# EAGLE design ALLtheLEDs (EAGLE 5.09)
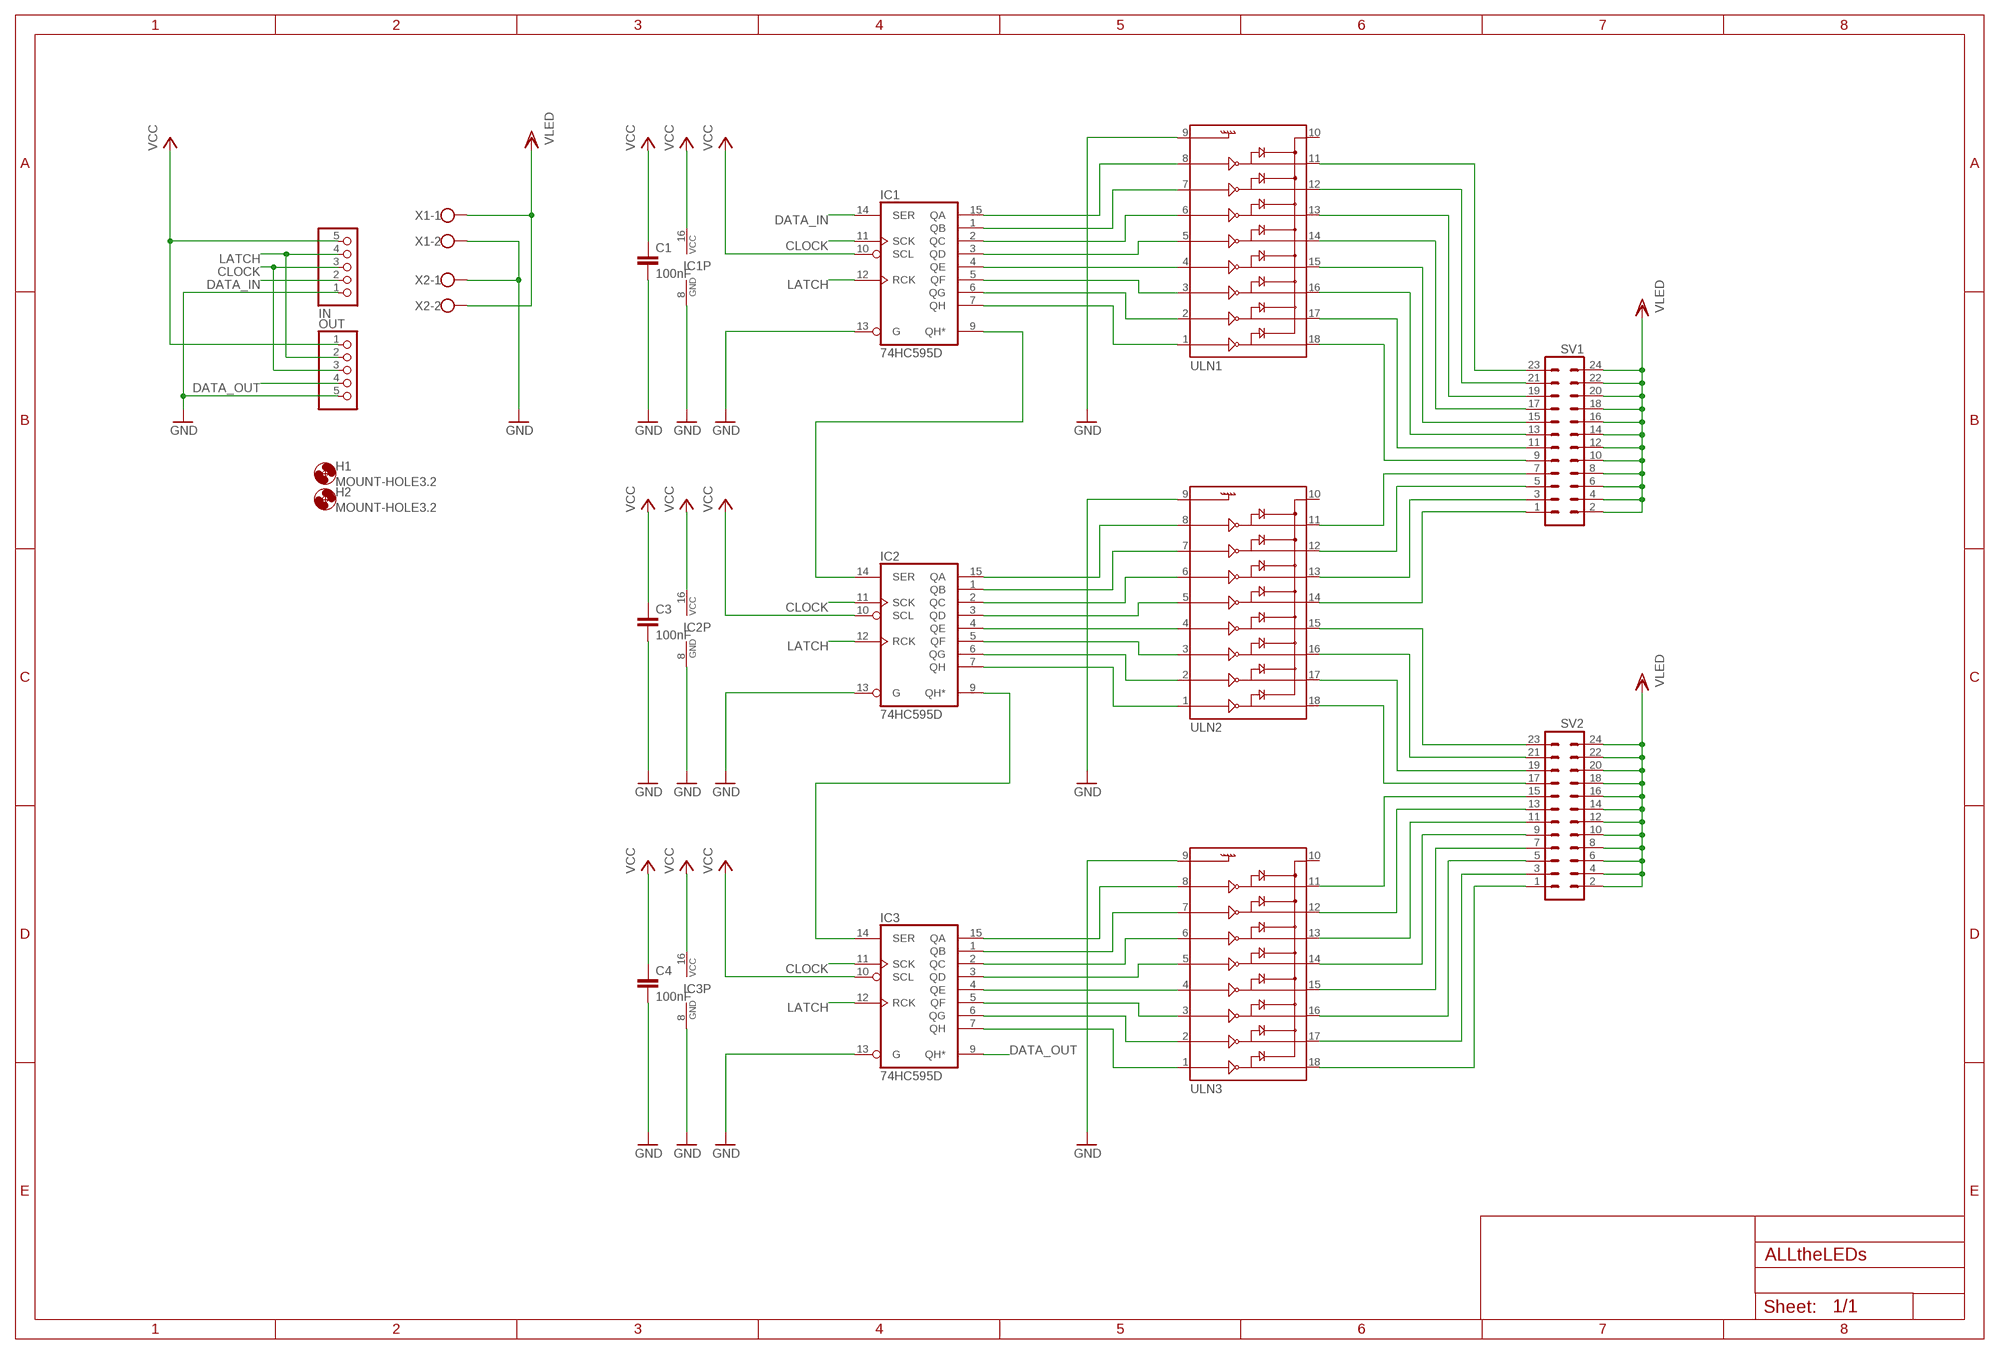
[diagram p0: schematic, sheet 1]

## Parts
C1  100nF  C-EUC0603  [C0603]
C3  100nF  C-EUC0603  [C0603]
C4  100nF  C-EUC0603  [C0603]
H1  MOUNT-HOLE3.2  [3,2]
H2  MOUNT-HOLE3.2  [3,2]
IC1  74HC595D  [SO16]
IC2  74HC595D  [SO16]
IC3  74HC595D  [SO16]
IN  PINHD-1X5/90  [1X05/90]
OUT  PINHD-1X5/90  [1X05/90]
SV1  MA12-2W  [MA12-2W]
SV2  MA12-2W  [MA12-2W]
ULN1  ULN2803SOICW  [SO18L]
ULN2  ULN2803SOICW  [SO18L]
ULN3  ULN2803SOICW  [SO18L]
X1  W237-102  [W237-102]
X2  W237-102  [W237-102]

## Nets
CLOCK: IC1.11(SCK) IC2.11(SCK) IC3.11(SCK) IN.3 OUT.3
DATA_IN: IC1.14(SER) IN.2
DATA_OUT: IC3.9(QH*) OUT.4
GND: C1.2 C3.2 C4.2 IC1.8(GND) IC1.13(G) IC2.8(GND) IC2.13(G) IC3.8(GND) IC3.13(G) IN.1 OUT.5 ULN1.9 ULN2.9 ULN3.9 X1.2 X2.1
LATCH: IC1.12(RCK) IC2.12(RCK) IC3.12(RCK) IN.4 OUT.2
N$1: IC1.15(QA) ULN1.8
N$2: IC1.1(QB) ULN1.7
N$3: IC1.2(QC) ULN1.6
N$4: IC1.3(QD) ULN1.5
N$5: IC1.4(QE) ULN1.4
N$6: IC1.5(QF) ULN1.3
N$7: IC1.6(QG) ULN1.2
N$8: IC1.7(QH) ULN1.1
N$9: IC2.15(QA) ULN2.8
N$10: IC2.1(QB) ULN2.7
N$11: IC2.2(QC) ULN2.6
N$12: IC2.3(QD) ULN2.5
N$13: IC2.4(QE) ULN2.4
N$14: IC2.5(QF) ULN2.3
N$15: IC2.6(QG) ULN2.2
N$16: IC2.7(QH) ULN2.1
N$17: IC3.15(QA) ULN3.8
N$18: IC3.1(QB) ULN3.7
N$19: IC3.2(QC) ULN3.6
N$20: IC3.3(QD) ULN3.5
N$21: IC3.4(QE) ULN3.4
N$22: IC3.5(QF) ULN3.3
N$23: IC3.6(QG) ULN3.2
N$24: IC3.7(QH) ULN3.1
N$25: IC2.9(QH*) IC3.14(SER)
N$26: IC1.9(QH*) IC2.14(SER)
N$27: SV1.23 ULN1.11
N$28: SV1.21 ULN1.12
N$29: SV1.19 ULN1.13
N$30: SV1.17 ULN1.14
N$31: SV1.15 ULN1.15
N$32: SV1.13 ULN1.16
N$33: SV1.11 ULN1.17
N$34: SV1.9 ULN1.18
N$35: SV1.1 ULN2.14
N$36: SV1.7 ULN2.11
N$37: SV1.5 ULN2.12
N$38: SV1.3 ULN2.13
N$39: SV2.1 ULN3.18
N$40: SV2.3 ULN3.17
N$41: SV2.5 ULN3.16
N$42: SV2.7 ULN3.15
N$43: SV2.9 ULN3.14
N$44: SV2.11 ULN3.13
N$45: SV2.13 ULN3.12
N$46: SV2.15 ULN3.11
N$47: SV2.17 ULN2.18
N$48: SV2.19 ULN2.17
N$49: SV2.21 ULN2.16
N$50: SV2.23 ULN2.15
VCC: C1.1 C3.1 C4.1 IC1.10(SCL) IC1.16(VCC) IC2.10(SCL) IC2.16(VCC) IC3.10(SCL) IC3.16(VCC) IN.5 OUT.1
VSS: SV1.2 SV1.4 SV1.6 SV1.8 SV1.10 SV1.12 SV1.14 SV1.16 SV1.18 SV1.20 SV1.22 SV1.24 SV2.2 SV2.4 SV2.6 SV2.8 SV2.10 SV2.12 SV2.14 SV2.16 SV2.18 SV2.20 SV2.22 SV2.24 X1.1 X2.2 ; supply symbol labelled VLED
Unconnected: ULN1.10 ULN2.10 ULN3.10

## Library data of the parts
C1 C3 C4 = rcl:C-EU: CAPACITOR, European symbol
H1 H2 = holes:MOUNT-HOLE: MOUNTING HOLE with drill center marker
IC1-IC3 = 74xx-eu:74*595: 8-bit SHIFT REGISTER, output latch
IN OUT = pinhead:PINHD-1X5: PIN HEADER
SV1 SV2 = con-lstb:MA12-2W: PIN HEADER
ULN1-ULN3 = SparkFun:ULN2803: Darlington Driver ULN2803 Darlington array. 500mA max per channel, 8-channel package. Spark Fun Electronics SKU : COM-00312
X1 X2 = con-wago-500:W237-102: WAGO SCREW CLAMP

## Board
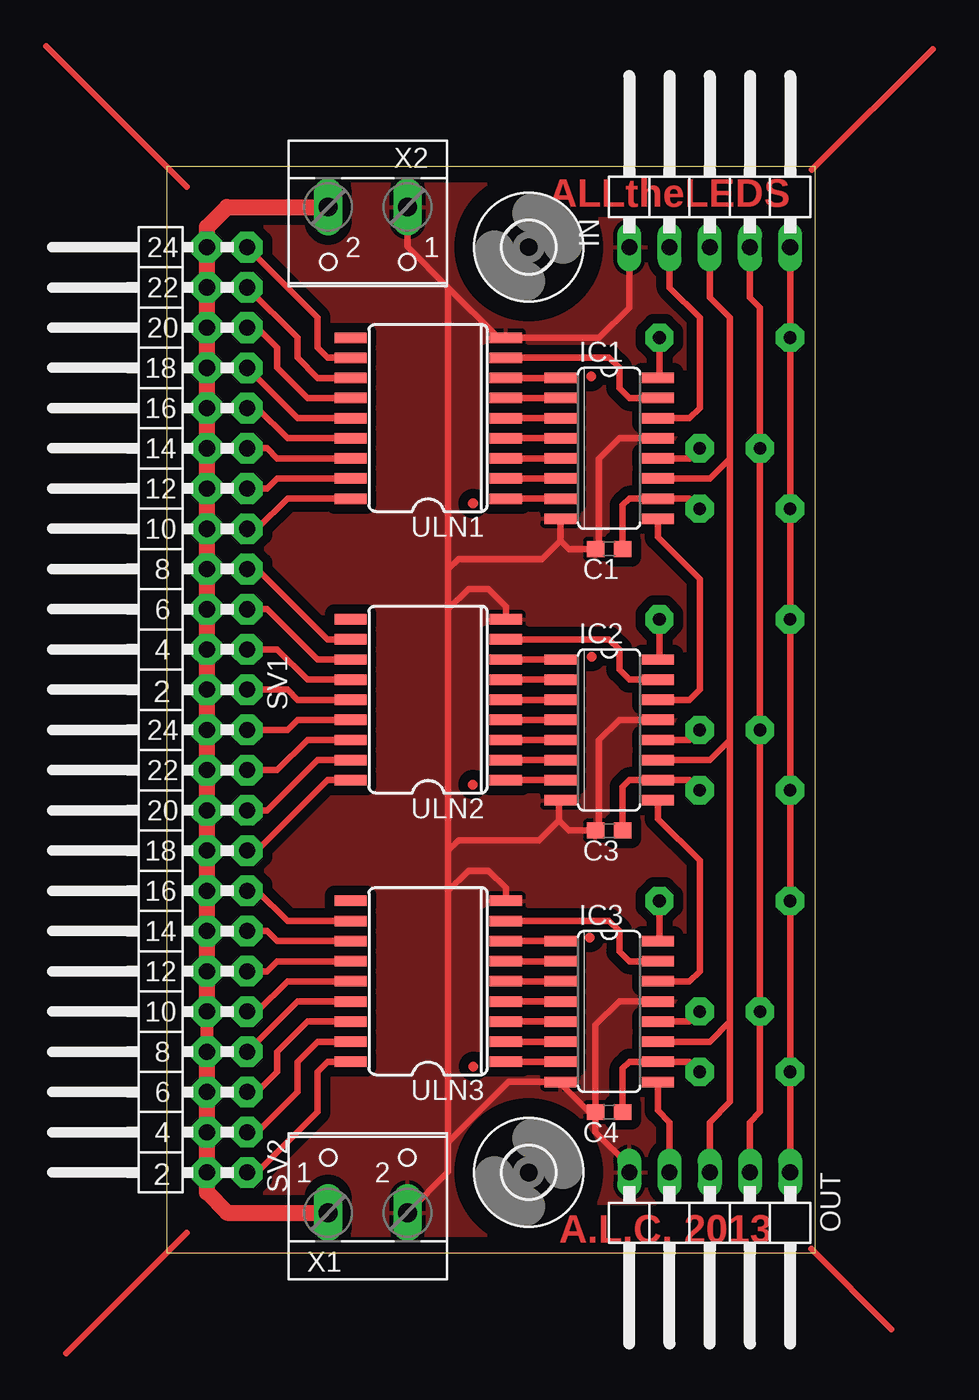
[diagram p1: board, top side]
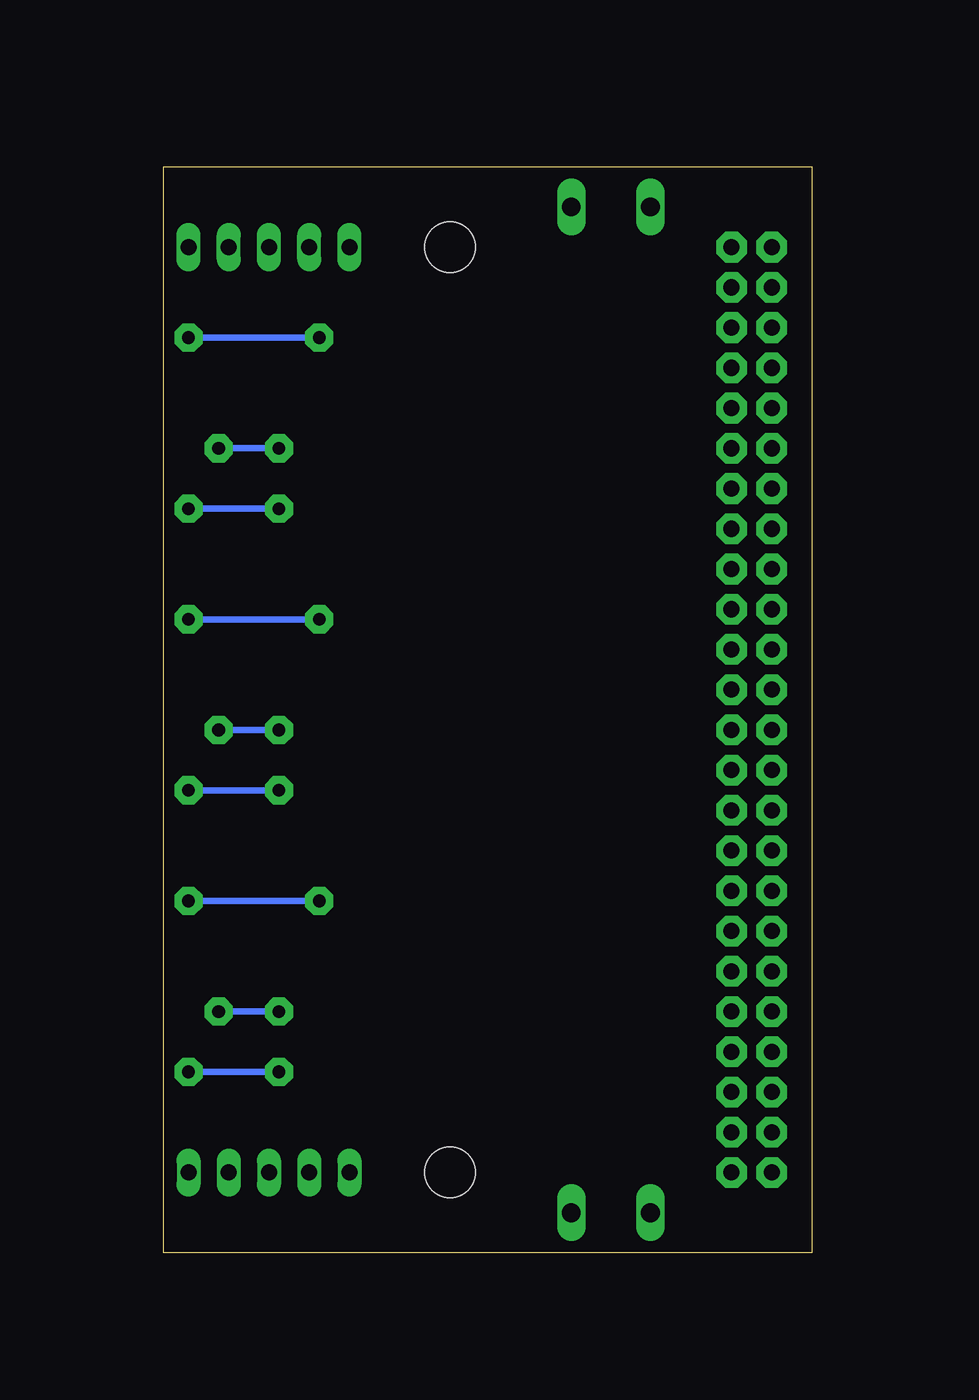
[diagram p2: board, bottom side, seen from below]

Size 40.95 x 68.57 mm. Coordinates in mm from the lower left corner, seen from the top.
Outline: 0,0 40.95,0 40.95,68.57 0,68.57 0,0
Copper layers (1*16): Top 0.035mm / dielectric 1.5mm / Bottom 0.035mm
Design rules "default": minimum track width 10mil, minimum drill 24mil, track to track 8mil, track to pad 8mil, pad to pad 8mil, via to via 8mil, smd to smd 8mil, copper to edge 40mil, drill to drill 8mil, minimum pad ring 10mil, minimum via ring 8mil, stop-mask expansion 4mil, vias tented up to drill 0mil, thermal gap 10mil

### Footprints (pad centres in the part's own frame; a part is rotated, then mirrored left to right if it is on the bottom)
C0603 = smd 1.1 x 1: 1 -0.85,0; 2 0.85,0
3,2 = hole 3.2: 0,0
SO16 = smd 0.66 x 2.032: 1 -4.445,-3.073; 2 -3.175,-3.073; 3 -1.905,-3.073; 4 -0.635,-3.073; 5 0.635,-3.073; 6 1.905,-3.073; 7 3.175,-3.073; 8 4.445,-3.073; 9 4.445,3.073; 10 3.175,3.073; 11 1.905,3.073; 12 0.635,3.073; 13 -0.635,3.073; 14 -1.905,3.073; 15 -3.175,3.073; 16 -4.445,3.073
1X05/90 = drill 1.016 long: 1 -5.08,-3.81; 2 -2.54,-3.81; 3 0,-3.81; 4 2.54,-3.81; 5 5.08,-3.81
MA12-2W = drill 1.016 pad 1.93 octagon: 1 -13.97,-1.27; 2 -13.97,1.27; 3 -11.43,-1.27; 4 -11.43,1.27; 5 -8.89,-1.27; 6 -8.89,1.27; 7 -6.35,-1.27; 8 -6.35,1.27; 9 -3.81,-1.27; 10 -3.81,1.27; 11 -1.27,-1.27; 12 -1.27,1.27; 13 1.27,-1.27; 14 1.27,1.27; 15 3.81,-1.27; 16 3.81,1.27; 17 6.35,-1.27; 18 6.35,1.27; 19 8.89,-1.27; 20 8.89,1.27; 21 11.43,-1.27; 22 11.43,1.27; 23 13.97,-1.27; 24 13.97,1.27
SO18L = smd 0.66 x 2.032: 1 -0.635,-4.902; 2 0.635,-4.902; 3 1.905,-4.902; 4 3.175,-4.902; 5 4.445,-4.902; 6 5.715,-4.902; 7 6.985,-4.902; 8 8.255,-4.902; 9 9.525,-4.902; 10 9.525,4.902; 11 8.255,4.902; 12 6.985,4.902; 13 5.715,4.902; 14 4.445,4.902; 15 3.175,4.902; 16 1.905,4.902; 17 0.635,4.902; 18 -0.635,4.902
W237-102 = drill 1.194 long: 1 -2.5,-1.27; 2 2.5,-1.27

### Placement (x,y rotation side)
C1  27.94,44.45 180 top
C3  27.94,26.67 180 top
C4  27.94,8.89 180 top
H1  22.86,5.08 0 top
H2  22.86,63.5 0 top
IC1  27.94,50.8 270 top
IC2  27.94,33.02 270 top
IC3  27.94,15.24 270 top
IN  34.29,67.31 0 top
OUT  34.29,1.27 180 top
SV1  3.81,49.53 90 top
SV2  3.81,19.05 90 top
ULN1  16.51,48.26 90 top
ULN2  16.51,30.48 90 top
ULN3  16.51,12.7 90 top
X1  12.7,3.81 0 top
X2  12.7,64.77 180 top

### Tracks (layer width: path | path; a pad name or v marks a point on that pad's centre or on a via)
CLOCK
  Top 0.406: OUT.3 34.29,8.26 35.56,9.53 35.56,14.61 | IC3.11 34.29,13.34 35.56,14.61 | IN.3 34.29,60.33 35.56,59.05 35.56,50.16 | 35.56,50.16 34.29,48.9 IC1.11 | 35.56,32.38 35.56,50.16 | 35.56,32.38 34.29,31.11 IC2.11 | 35.56,14.61 35.56,32.38
DATA_IN
  Top 0.406: IC1.14 33.02,52.7 33.66,53.34 33.66,59.05 31.75,60.96 IN.2
DATA_OUT
  Top 0.406: IC3.9 31.01,8.99 31.75,8.26 OUT.4
GND
  Top 0.406: 24.87,44.98 IC1.8 | 24.87,44.98 25.4,44.45 C1.2 27.3,44.66 27.3,50.16 28.57,51.44 IC1.13 | 17.78,43.18 18.41,43.81 23.7,43.81 24.87,44.98 | ULN2.9 21.41,40.82 20.32,41.91 19.05,41.91 17.78,40.64 | 17.78,25.4 17.78,40.64 | 17.78,25.4 18.41,26.04 23.5,26.04 24.77,27.3 | 24.77,27.3 24.77,28.47 IC2.8 | 24.77,27.3 25.4,26.67 C3.2 27.3,26.89 27.3,32.38 28.57,33.66 IC2.13 | 17.78,40.64 17.78,43.18 | ULN3.9 21.41,23.04 20.32,24.13 19.05,24.13 17.78,22.86 | 17.78,22.86 17.78,25.4 | IC3.13 28.57,15.88 27.09,14.39 C4.2 | C4.2 27.09,7.62 29.21,5.5 OUT.5 | X2.1 15.2,63.54 17.78,60.96 | 17.78,6.99 17.78,5.12 X1.2 | 17.78,6.99 17.78,22.86 | IN.1 29.21,59.69 27.3,57.78 ULN1.9 20.95,57.78 17.78,60.96 | 17.78,43.18 17.78,60.96 | C4.2 26.67,8.89 24.87,10.69 IC3.8 21.59,10.79 17.78,6.99
  pour Top (isolate 0.61): 0,68.58 40.64,68.58 40.64,0 0,0
LATCH  (via drill 0.8 pad 1.78)
  Top 0.406: IN.4 36.83,60.33 37.47,59.69 v37.47,50.8 v37.47,33.02 v37.47,15.24 37.47,8.89 36.83,8.26 OUT.2 | IC1.12 33.02,50.16 v33.66,50.8 | IC2.12 33.02,32.38 v33.66,33.02 | IC3.12 33.02,14.61 v33.66,15.24
  Bottom 0.406: v37.47,50.8 v33.66,50.8 | v37.47,33.02 v33.66,33.02 | v37.47,15.24 v33.66,15.24
N$1
  Top 0.406: IC1.15 29.21,53.98 28.57,54.61 28.57,55.88 27.94,56.52 ULN1.8
N$2
  Top 0.406: ULN1.7 IC1.1
N$3
  Top 0.406: ULN1.6 IC1.2
N$4
  Top 0.406: ULN1.5 IC1.3
N$5
  Top 0.406: ULN1.4 IC1.4
N$6
  Top 0.406: ULN1.3 IC1.5
N$7
  Top 0.406: ULN1.2 IC1.6
N$8
  Top 0.406: ULN1.1 IC1.7
N$9
  Top 0.406: IC2.15 29.21,36.2 28.57,36.83 28.57,38.1 27.94,38.73 ULN2.8
N$10
  Top 0.406: ULN2.7 IC2.1
N$11
  Top 0.406: ULN2.6 IC2.2
N$12
  Top 0.406: ULN2.5 IC2.3
N$13
  Top 0.406: ULN2.4 IC2.4
N$14
  Top 0.406: ULN2.3 IC2.5
N$15
  Top 0.406: ULN2.2 IC2.6
N$16
  Top 0.406: ULN2.1 IC2.7
N$17
  Top 0.406: ULN3.8 27.94,20.95 28.57,20.32 28.57,19.05 29.21,18.41 IC3.15
N$18
  Top 0.406: ULN3.7 IC3.1
N$19
  Top 0.406: ULN3.6 IC3.2
N$20
  Top 0.406: ULN3.5 IC3.3
N$21
  Top 0.406: ULN3.4 IC3.4
N$22
  Top 0.406: ULN3.3 IC3.5
N$23
  Top 0.406: ULN3.2 IC3.6
N$24
  Top 0.406: ULN3.1 IC3.7
N$25
  Top 0.406: IC2.9 31.01,27.41 33.66,24.77 33.66,17.78 33.02,17.14 IC3.14
N$26
  Top 0.406: IC1.9 31.01,45.19 33.66,42.55 33.66,35.56 33.02,34.92 IC2.14
N$27
  Top 0.406: SV1.23 9.53,59.05 9.53,57.15 10.16,56.52 ULN1.11
N$28
  Top 0.406: SV1.21 8.26,57.78 8.26,56.52 9.53,55.24 ULN1.12
N$29
  Top 0.406: SV1.19 5.71,58.42 6.99,57.15 6.99,55.88 8.89,53.98 ULN1.13
N$30
  Top 0.406: SV1.17 8.26,52.7 ULN1.14
N$31
  Top 0.406: SV1.15 5.71,53.34 7.62,51.44 ULN1.15
N$32
  Top 0.406: SV1.13 6.35,50.8 6.99,50.16 ULN1.16
N$33
  Top 0.406: SV1.11 6.35,48.26 6.99,48.9 ULN1.17
N$34
  Top 0.406: SV1.9 5.71,45.72 7.62,47.62 ULN1.18
N$35
  Top 0.406: SV1.1 7.62,35.56 8.26,34.92 ULN2.14
N$36
  Top 0.406: ULN2.11 10.16,38.73 5.71,43.18 SV1.7
N$37
  Top 0.406: ULN2.12 9.53,37.47 6.35,40.64 SV1.5
N$38
  Top 0.406: ULN2.13 8.89,36.2 6.99,38.1 SV1.3
N$39
  Top 0.406: ULN3.18 10.16,12.06 9.53,11.43 9.53,8.89 5.71,5.08 SV2.1
N$40
  Top 0.406: ULN3.17 9.53,13.34 8.26,12.06 8.26,10.16 5.71,7.62 SV2.3
N$41
  Top 0.406: ULN3.16 8.89,14.61 6.99,12.7 6.99,11.43 5.71,10.16 SV2.5
N$42
  Top 0.406: SV2.7 8.26,15.88 ULN3.15
N$43
  Top 0.406: ULN3.14 7.62,17.14 5.71,15.24 SV2.9
N$44
  Top 0.406: SV2.11 6.35,17.78 6.99,18.41 ULN3.13
N$45
  Top 0.406: ULN3.12 6.99,19.68 6.35,20.32 SV2.13
N$46
  Top 0.406: SV2.15 5.71,22.86 7.62,20.95 ULN3.11
N$47
  Top 0.406: ULN2.18 10.16,29.84 5.71,25.4 SV2.17
N$48
  Top 0.406: ULN2.17 9.53,31.11 6.35,27.94 SV2.19
N$49
  Top 0.406: ULN2.16 8.89,32.38 6.99,30.48 SV2.21
N$50
  Top 0.406: SV2.23 7.62,33.02 8.26,33.66 ULN2.15
N$51  (via drill 0.6)
  other vias: 22.86,5.08
N$52  (via drill 0.6)
  other vias: 22.86,63.5
N$53
  Top 0.406: 1.27,67.31 -7.62,76.2
N$54
  Top 0.406: 40.75,68.39 48.37,76
N$55
  Top 0.406: 1.27,1.27 -6.35,-6.35
N$56
  Top 0.406: 40.69,0.25 45.77,-4.83
VCC  (via drill 0.8 pad 1.78)
  Top 0.406: C1.1 28.79,47.2 29.21,47.62 IC1.10 33.02,47.62 v33.66,46.99 | C3.1 28.79,29.43 29.21,29.84 IC2.10 33.02,29.84 v33.66,29.21 | IN.5 v39.37,57.78 v39.37,46.99 v39.37,40.01 v39.37,29.21 v39.37,22.23 v39.37,11.43 OUT.1 | C4.1 28.79,11.64 29.21,12.06 IC3.10 33.02,12.06 v33.66,11.43 | v31.11,57.78 31.11,55.35 IC1.16 | v31.11,40.01 31.11,37.57 IC2.16 | v31.11,22.23 31.11,19.79 IC3.16
  Bottom 0.406: v39.37,57.78 v31.11,57.78 | v39.37,40.01 v31.11,40.01 | v39.37,46.99 v33.66,46.99 | v39.37,22.23 v31.11,22.23 | v39.37,29.21 v33.66,29.21 | v33.66,11.43 v39.37,11.43
VSS
  Top 0.813: SV2.8 SV2.10
  Top 1.016: SV2.10 SV2.12 SV2.14 SV2.16 SV2.18 SV2.20 SV2.22 SV2.24 SV1.2 SV1.4 SV1.6 SV1.8 SV1.10 SV1.12 SV1.14 SV1.16 SV1.18 SV1.20 SV1.22 SV1.24 2.54,64.77 3.81,66.04 X2.2 | SV2.8 SV2.6 SV2.4 SV2.2 2.54,3.81 3.81,2.54 X1.1
(copper drawn outside any net)
  shapes: Top circle x6

### Text on the board
Top: ALLtheLEDS | A.L.C. 2013